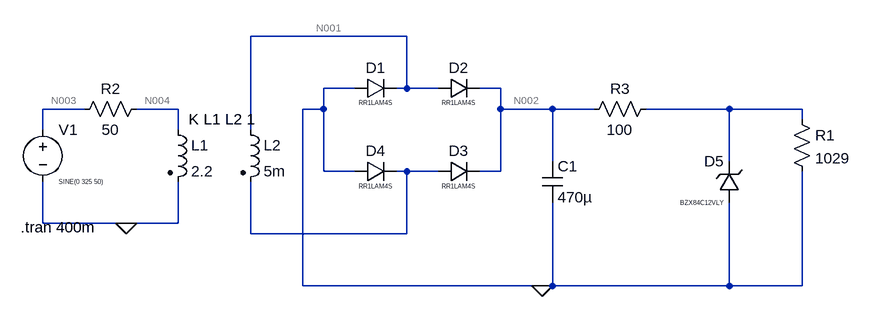
[diagram p0: schematic 200029B.asc]
200029B.asc, the LTspice schematic file:
Version 4
SHEET 1 1076 680
WIRE 384 32 144 32
WIRE 304 112 256 112
WIRE 384 112 384 32
WIRE 384 112 368 112
WIRE 432 112 384 112
WIRE 528 112 496 112
WIRE -112 144 -176 144
WIRE 32 144 -32 144
WIRE 256 144 256 112
WIRE 256 144 224 144
WIRE 528 144 528 112
WIRE 608 144 528 144
WIRE 672 144 608 144
WIRE 880 144 752 144
WIRE 992 144 880 144
WIRE 992 160 992 144
WIRE -176 176 -176 144
WIRE 32 176 32 144
WIRE 144 176 144 32
WIRE 608 224 608 144
WIRE 880 224 880 144
WIRE 256 240 256 144
WIRE 304 240 256 240
WIRE 384 240 368 240
WIRE 432 240 384 240
WIRE 528 240 528 144
WIRE 528 240 496 240
WIRE -176 320 -176 256
WIRE -48 320 -176 320
WIRE 32 320 32 256
WIRE 32 320 -48 320
WIRE 144 336 144 256
WIRE 384 336 384 240
WIRE 384 336 144 336
WIRE 224 416 224 144
WIRE 592 416 224 416
WIRE 608 416 608 288
WIRE 608 416 592 416
WIRE 880 416 880 288
WIRE 880 416 608 416
WIRE 992 416 992 240
WIRE 992 416 880 416
FLAG -48 320 0
FLAG 592 416 0
SYMBOL ind2 16 160 R0
SYMATTR InstName L1
SYMATTR Value 2.2
SYMATTR Type ind
SYMBOL ind2 128 160 R0
SYMATTR InstName L2
SYMATTR Value 5m
SYMATTR Type ind
SYMBOL voltage -176 160 R0
WINDOW 3 24 96 Left 0
WINDOW 123 0 0 Left 0
WINDOW 39 24 124 Left 0
SYMATTR InstName V1
SYMATTR Value SINE(0 325 50)
SYMBOL res -16 128 R90
WINDOW 0 0 56 VBottom 2
WINDOW 3 32 56 VTop 2
SYMATTR InstName R2
SYMATTR Value 50
SYMBOL diode 304 128 R270
WINDOW 0 32 32 VTop 2
WINDOW 3 0 32 VBottom 0
SYMATTR InstName D1
SYMATTR Value RR1LAM4S
SYMBOL diode 432 128 R270
WINDOW 0 32 32 VTop 2
WINDOW 3 0 32 VBottom 0
SYMATTR InstName D2
SYMATTR Value RR1LAM4S
SYMBOL diode 432 256 R270
WINDOW 0 32 32 VTop 2
WINDOW 3 0 32 VBottom 0
SYMATTR InstName D3
SYMATTR Value RR1LAM4S
SYMBOL diode 304 256 R270
WINDOW 0 32 32 VTop 2
WINDOW 3 0 32 VBottom 0
SYMATTR InstName D4
SYMATTR Value RR1LAM4S
SYMBOL res 976 144 R0
SYMATTR InstName R1
SYMATTR Value 1029
SYMBOL cap 592 224 R0
SYMATTR InstName C1
SYMATTR Value 470µ
SYMBOL res 768 128 R90
WINDOW 0 0 56 VBottom 2
WINDOW 3 32 56 VTop 2
SYMATTR InstName R3
SYMATTR Value 100
SYMBOL zener 896 288 R180
WINDOW 0 24 64 Left 2
WINDOW 3 24 0 Left 0
SYMATTR InstName D5
SYMATTR Value BZX84C12VLY
SYMATTR Description Diode
SYMATTR Type diode
TEXT 48 160 Left 2 !K L1 L2 1
TEXT -210 326 Left 2 !.tran 400m

The netlist it stands for:
* 200029B.asc
L1 N004 0 2.2
L2 N001 N006 5m
V1 N003 0 SINE(0 325 50)
R2 N004 N003 50
D1 0 N001 RR1LAM4S
D2 N001 N002 RR1LAM4S
D3 N006 N002 RR1LAM4S
D4 0 N006 RR1LAM4S
R1 N005 0 1029
C1 N002 0 470µ
R3 N005 N002 100
D5 0 N005 BZX84C12VLY
.model D D
.lib standard.dio
K L1 L2 1
.tran 400m
.backanno
.end

* Results of the author's LTspice run, read from the files saved beside the schematic
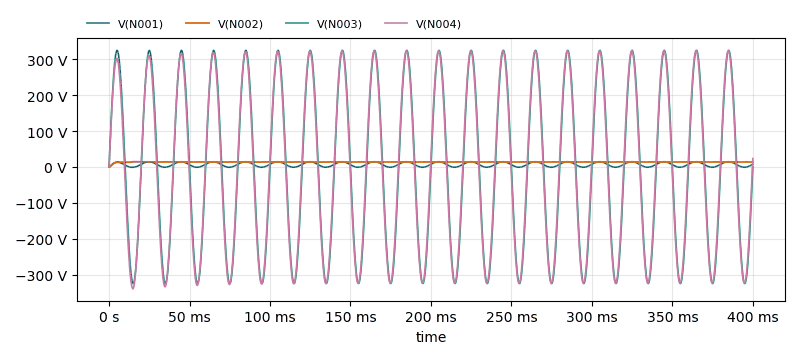
[diagram p1: Transient Analysis of 200029B.asc, plotted from the saved traces]
* Transient Analysis, 1 run:
*   V(N001): min -906.5 mV, max 14.64 V, average 6.78 V, rms 8.692 V, last 7.414 V
*   V(N002): min 0 V, max 14.67 V, average 13.68 V, rms 13.71 V, last 13.71 V
*   V(N003): min -325 V, max 325 V, average -1.454 mV, rms 229.9 V, last 0 V
*   V(N004): min -339.7 V, max 323.7 V, average -2.575 V, rms 228.6 V, last 23.36 V